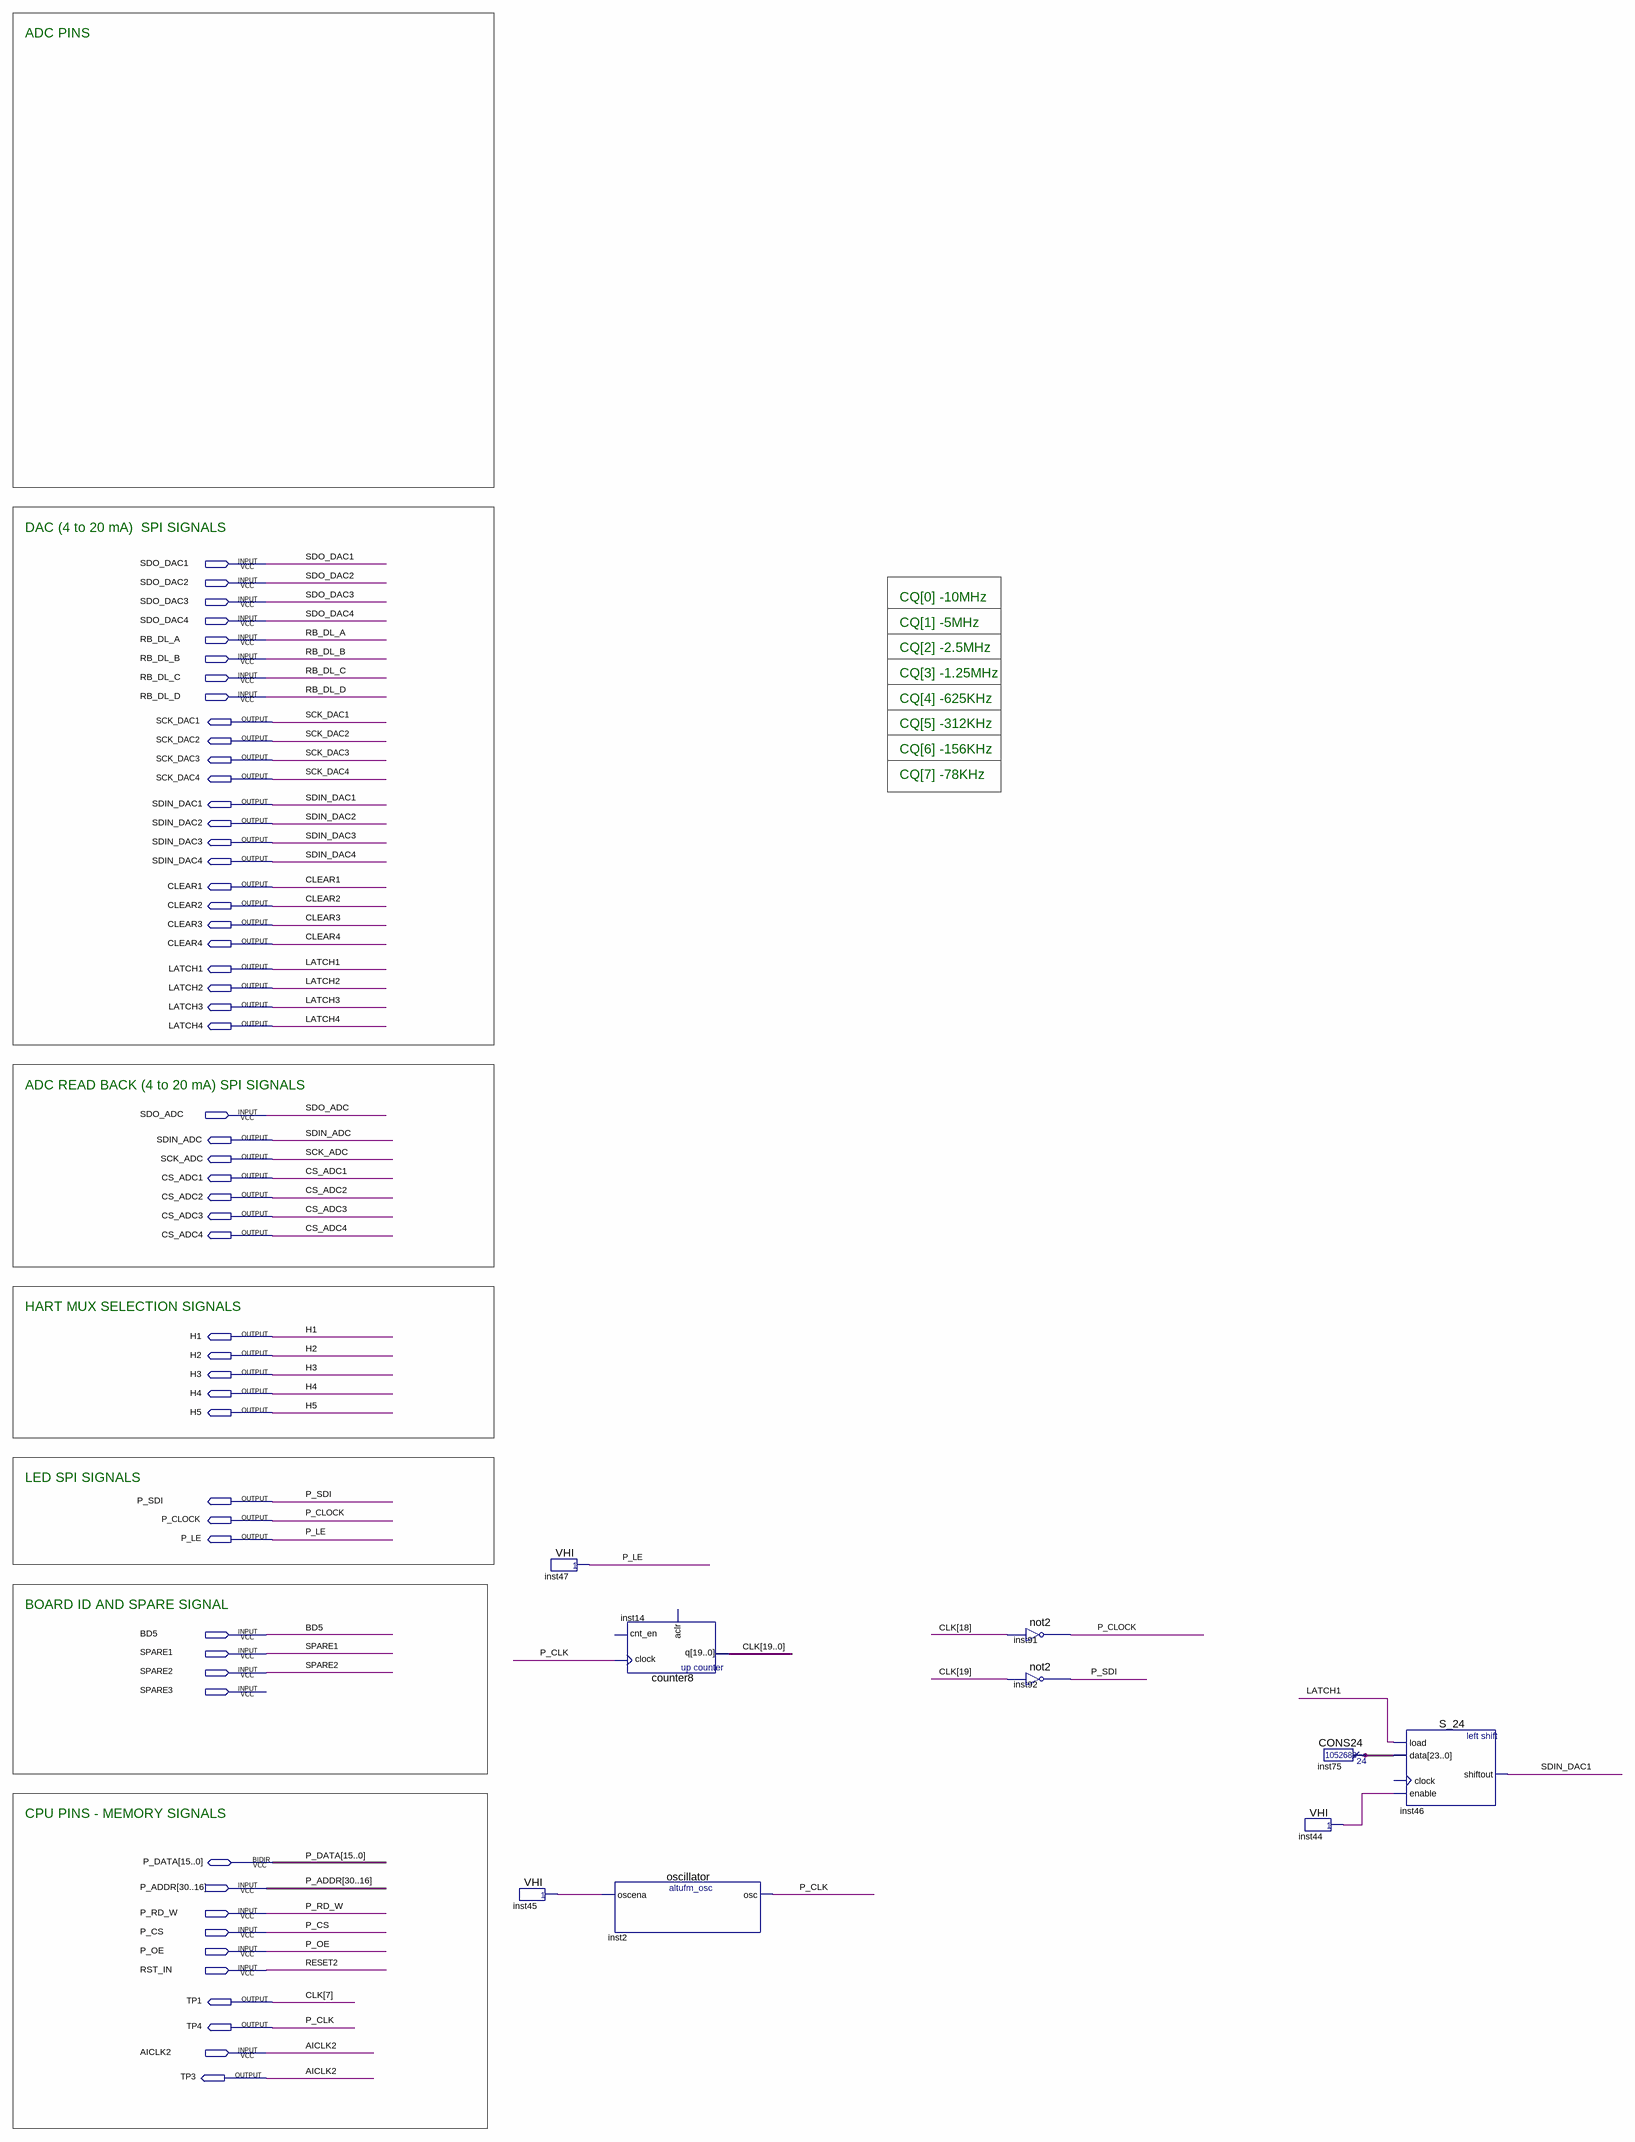
[diagram p0: schematic sheet]
// Quartus schematic IOP.bdf as structural Verilog: 9 symbols, 53 pins
module IOP (
  input  SDO_DAC1,
  input  SDO_DAC2,
  input  SDO_DAC3,
  input  SDO_DAC4,
  input  RB_DL_A,
  input  RB_DL_B,
  input  RB_DL_C,
  input  RB_DL_D,
  input  SDO_ADC,
  input  BD5,
  input  SPARE1,
  input  SPARE2,
  input  SPARE3,
  input  [30:16] P_ADDR,
  input  P_RD_W,
  input  P_CS,
  input  P_OE,
  input  RST_IN,
  input  AICLK2,
  inout  [15:0] P_DATA,
  output SCK_DAC1,
  output SCK_DAC2,
  output SCK_DAC3,
  output SCK_DAC4,
  output SDIN_DAC1,
  output SDIN_DAC2,
  output SDIN_DAC3,
  output SDIN_DAC4,
  output CLEAR1,
  output CLEAR2,
  output CLEAR3,
  output CLEAR4,
  output LATCH1,
  output LATCH2,
  output LATCH3,
  output LATCH4,
  output SDIN_ADC,
  output SCK_ADC,
  output CS_ADC1,
  output CS_ADC2,
  output CS_ADC3,
  output CS_ADC4,
  output H1,
  output H2,
  output H3,
  output H4,
  output H5,
  output P_SDI,
  output P_CLOCK,
  output P_LE,
  output TP1,
  output TP4,
  output TP3
);

  wire inst44_result, inst45_result;
  wire [19:0] CLK;
  wire [23:0] inst75_result;

  VHI inst45 (.result(inst45_result));
  VHI inst47 (.result(P_LE));
  oscillator inst2 (.oscena(inst45_result), .osc(TP4));
  counter8 inst14 (.clock(TP4), .q({CLK[19:8], TP1, CLK[6:0]}));  // open: cnt_en, aclr
  not2 inst91 (.data(CLK[18]), .result(P_CLOCK));
  not2 inst92 (.data(CLK[19]), .result(P_SDI));
  CONS24 inst75 (.result(inst75_result));
  VHI inst44 (.result(inst44_result));
  S_24 inst46 (.load(LATCH1), .data(inst75_result), .enable(inst44_result), .shiftout(SDIN_DAC1));  // open: clock

  assign TP3 = AICLK2;

  // Other names for the same wires on the sheet: CLK[7] = TP1; P_CLK = TP4; RESET2 = RST_IN

  // Notes on the sheet:
  //   ADC PINS
  //   DAC (4 to 20 mA)  SPI SIGNALS
  //   CQ[0] -
  //   10MHz
  //   CQ[1] -
  //   5MHz
  //   CQ[2] -
  //   2.5MHz
  //   CQ[3] -
  //   1.25MHz
  //   CQ[4] -
  //   625KHz
  //   CQ[5] -
  //   312KHz
  //   CQ[6] -
  //   156KHz
  //   CQ[7] -
  //   78KHz
  //   ADC READ BACK (4 to 20 mA) SPI SIGNALS
  //   HART MUX SELECTION SIGNALS
  //   LED SPI SIGNALS
  //   BOARD ID AND SPARE SIGNAL
  //   CPU PINS - MEMORY SIGNALS
endmodule
